# Altium schematic sheet WLAN_BLUETOOTH.SchDoc: WLAN & Bluetooth
size A4; Project: STM32MP15-DISCO PI; Date: Not used; ApprovedBy: Not used; CheckedBy: Not used; Author: Not used; CompanyName: STMicroelectronics; DrawnBy: Not used; Engineer: Not used; Organization: Not used; Address1: Not used; Address2: Not used; Address3: Not used; Address4: Not used; DocumentNumber: 9; Revision: Not used; SheetNumber: 9; SheetTotal: 17; CurrentTime: Not used; CurrentDate: Not used; Time: Not used; DocumentFullPathAndName: Not used; DocumentName: Not used; ModifiedDate: Not used; ImagePath: Not used; ProjectName: Not used; Application_BuildNumber: Not used
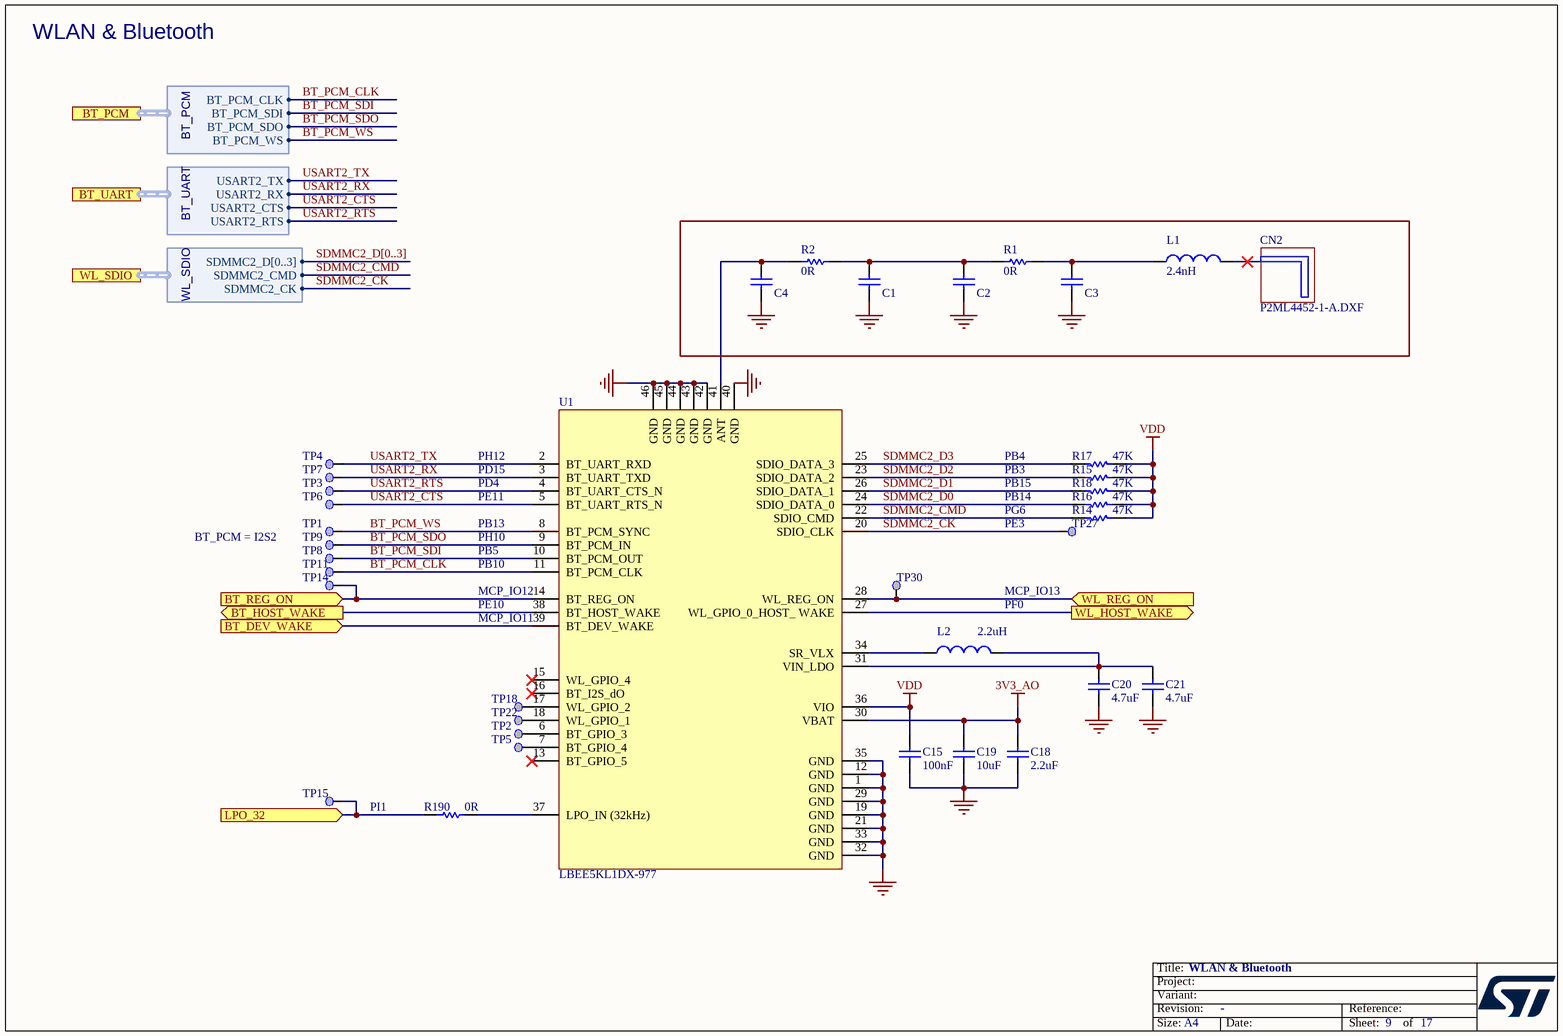
[diagram p0: WLAN_BLUETOOTH.SchDoc]

## Parts
C1  Capacitor  [C0402]  (value not drawn)
C2  Capacitor  [C0402]  (value not drawn)
C3  Capacitor  [C0402]  (value not drawn)
C4  Capacitor  [C0402]  (value not drawn)
C15  value 100nF  [C0402]  (hidden comment: Capacitor)
C18  value 2.2uF  [C0201_H0P5]  (hidden comment: Capacitor)
C19  value 10uF  [C0603]  (hidden comment: Capacitor)
C20  value 4.7uF  [C0402]  (hidden comment: Capacitor)
C21  value 4.7uF  [C0402]  (hidden comment: Capacitor)
CN2  value P2ML4452-1-A.DXF  [ANT_MURATA_TYPE-1-DX_P2ML4452-1-A_DXF]  (hidden comment: antenna_Wifi_BLE_Murata)  (no BOM)
L1  value 2.4nH  [IND_0402_MURATA_LQW15AN2N4C00X]  (hidden comment: Inductor)
L2  value 2.2uH  [L0603]  (hidden comment: Inductor)
R1  value 0R  [R0402]  (hidden comment: Resistor)
R2  value 0R  [R0402]  (hidden comment: Resistor)
R14  value 47K  [R0402]  (hidden comment: Resistor)
R15  value 47K  [R0402]  (hidden comment: Resistor)
R16  value 47K  [R0402]  (hidden comment: Resistor)
R17  value 47K  [R0402]  (hidden comment: Resistor)
R18  value 47K  [R0402]  (hidden comment: Resistor)
R190  value 0R  [R0402]  (hidden comment: Resistor)
TP1  Test Point  [TP_SMD_1MM]  (value not drawn)  (no BOM)
TP2  Test Point  [TP_SMD_1MM]  (value not drawn)  (no BOM)
TP3  Test Point  [TP_SMD_1MM]  (value not drawn)  (no BOM)
TP4  Test Point  [TP_SMD_1MM]  (value not drawn)  (no BOM)
TP5  Test Point  [TP_SMD_1MM]  (value not drawn)  (no BOM)
TP6  Test Point  [TP_SMD_1MM]  (value not drawn)  (no BOM)
TP7  Test Point  [TP_SMD_1MM]  (value not drawn)  (no BOM)
TP8  Test Point  [TP_SMD_1MM]  (value not drawn)  (no BOM)
TP9  Test Point  [TP_SMD_1MM]  (value not drawn)  (no BOM)
TP11  Test Point  [TP_SMD_1MM]  (value not drawn)  (no BOM)
TP14  Test Point  [TP_SMD_1MM]  (value not drawn)  (no BOM)
TP15  Test Point  [TP_SMD_1MM]  (value not drawn)  (no BOM)
TP18  Test Point  [TP_SMD_1MM]  (value not drawn)  (no BOM)
TP22  Test Point  [TP_SMD_1MM]  (value not drawn)  (no BOM)
TP27  Test Point  [TP_SMD_1MM]  (value not drawn)  (no BOM)
TP30  Test Point  [TP_SMD_1MM]  (value not drawn)  (no BOM)
U1  value LBEE5KL1DX-977  [MOD_WLAN-BT_MURATA_LBEE5KL1DX-883]  (hidden comment: LBEE5KL1DX-883)

## Ports
BT_DEV_WAKE (in), BT_HOST_WAKE (out), BT_PCM (harness BT_PCM), BT_REG_ON (in), BT_UART (harness BT_UART), LPO_32 (in), WL_HOST_WAKE (out), WL_REG_ON (in), WL_SDIO (harness WL_SDIO)

## Harnesses
BT_PCM: BT_PCM_CLK, BT_PCM_SDI, BT_PCM_SDO, BT_PCM_WS
BT_UART: USART2_TX, USART2_RX, USART2_CTS, USART2_RTS
WL_SDIO: SDMMC2_D[0..3], SDMMC2_CMD, SDMMC2_CK

## Nets
3V3_AO: C18.2 C19.2 U1.30(VBAT)
GND: C1.1 C2.1 C3.1 C4.1 C15.1 C18.1 C19.1 C20.1 C21.1 U1.1(GND) U1.12(GND) U1.19(GND) U1.21(GND) U1.29(GND) U1.32(GND) U1.33(GND) U1.35(GND) U1.40(GND) U1.42(GND) U1.43(GND) U1.44(GND) U1.45(GND) U1.46(GND)
VDD: C15.2 R14.1 R15.1 R16.1 R17.1 R18.1 U1.36(VIO)
BT_DEV_WAKE: U1.39(BT_DEV_WAKE) ; port BT_DEV_WAKE
BT_HOST_WAKE: U1.38(BT_HOST_WAKE) ; port BT_HOST_WAKE
BT_PCM_CLK: TP11.1 U1.11(BT_PCM_CLK) ; port BT_PCM.BT_PCM_CLK
BT_PCM_SDI: TP8.1 U1.10(BT_PCM_OUT) ; port BT_PCM.BT_PCM_SDI
BT_PCM_SDO: TP9.1 U1.9(BT_PCM_IN) ; port BT_PCM.BT_PCM_SDO
BT_PCM_WS: TP1.1 U1.8(BT_PCM_SYNC) ; port BT_PCM.BT_PCM_WS
BT_REG_ON: TP14.1 U1.14(BT_REG_ON) ; port BT_REG_ON
LPO_32: R190.1 TP15.1 ; port LPO_32
SDMMC2_CK: TP27.1 U1.20(SDIO_CLK) ; port WL_SDIO.SDMMC2_CK
SDMMC2_CMD: R14.2 U1.22(SDIO_CMD) ; port WL_SDIO.SDMMC2_CMD
SDMMC2_D0: R16.2 U1.24(SDIO_DATA_0)
SDMMC2_D1: R18.2 U1.26(SDIO_DATA_1)
SDMMC2_D2: R15.2 U1.23(SDIO_DATA_2)
SDMMC2_D3: R17.2 U1.25(SDIO_DATA_3)
USART2_CTS: TP6.1 U1.5(BT_UART_RTS_N) ; port BT_UART.USART2_CTS
USART2_RTS: TP3.1 U1.4(BT_UART_CTS_N) ; port BT_UART.USART2_RTS
USART2_RX: TP7.1 U1.3(BT_UART_TXD) ; port BT_UART.USART2_RX
USART2_TX: TP4.1 U1.2(BT_UART_RXD) ; port BT_UART.USART2_TX
WL_HOST_WAKE: U1.27(WL_GPIO_0_HOST__WAKE) ; port WL_HOST_WAKE
WL_REG_ON: TP30.1 U1.28(WL_REG_ON) ; port WL_REG_ON
NetC1_2: C1.2 C2.2 R1.2 R2.1
NetC3_2: C3.2 L1.1 R1.1
NetC4_2: C4.2 R2.2 U1.41(ANT)
NetC20_2: C20.2 C21.2 L2.2 U1.31(VIN_LDO)
NetL2_1: L2.1 U1.34(SR_VLX)
NetR190_2: R190.2 U1.37(LPO_IN_(32kHz))
NetTP2_1: TP2.1 U1.6(BT_GPIO_3)
NetTP5_1: TP5.1 U1.7(BT_GPIO_4)
NetTP18_1: TP18.1 U1.17(WL_GPIO_2)
NetTP22_1: TP22.1 U1.18(WL_GPIO_1)

Not connected (* = marked no-connect by the designer): L1 2*; U1 13(BT_GPIO_5)* 15(WL_GPIO_4)* 16(BT_I2S_dO)*

## Buses and harness runs
bus SDMMC2_D[0..3]

## Notes on the sheet
- WLAN & Bluetooth
- PD15
- PH12
- PD4
- PE11
- PG6
- PB14
- PB15
- PB3
- PB4
- BT_PCM = I2S2
- PB10
- PB5
- PH10
- PB13
- PE3
- PE10
- (near U1) MCP_IO11
- (near U1) MCP_IO12
- (near L2) PF0
- MCP_IO13
- PI1
- Title:
- Project:
- Size:
- Revision:
- Variant:
- A4
- -
- Date:
- Reference:
- Sheet:
- of

## Library data of the parts
C1-C4 = MCD-00200: Capacitor, MLCC, 12pF, 50V, NPO, +/-5%, 0402, T=0.5mm; Manufacturer_Part_Number: CC0402JRNPO9BN120; Manufacturer: YAGEO; Part_Preference: Recommended; Component_Country_Of_Origin: China; ShowFields: YES; ID: 2667; Internal_Part_Number: MCD-00200; Value: 12pF; Status: Checked; Part_Type: Capacitor; Package: 0402; ComponentLink1URL: http://tunmcdsvn.tun.st.com/Component_Documentation_Library/Trunk/Capacitor/YAGEO_NP0_Series; Order_Code_Digikey: 311-1016-1-ND; Order_Code_Farnell: 2370624; Order_Code_RS: N/A
C15 = MCD-00006: Capacitor, MLCC, 100nF, 16V, X7R, +/-10%, 0402, T=0.5mm; Manufacturer_Part_Number: CC0402KRX7R7BB104; Manufacturer: YAGEO; Part_Preference: Recommended; Order_Code_RS: 616-9701; Component_Country_Of_Origin: China; ShowFields: YES; ID: 2474; Internal_Part_Number: MCD-00006; Status: Released; Part_Type: Capacitor; Package: 0402; ComponentLink1URL: http://tunmcdsvn.tun.st.com/Component_Documentation_Library/Trunk/Capacitor/YAGEO_X7R_Series; Order_Code_Digikey: 311-1338-1-ND; Order_Code_Farnell: 9402047
C18 = MCD-02235: Capacitor, MLCC, 2.2uF, 10V, X5R,+/-10%, 0201, T=0.5mm; Manufacturer_Part_Number: GRM033R61A225KE47D; Manufacturer: MURATA; Part_Preference: Recommended; Order_Code_RS: NA; Component_Country_Of_Origin: Japan; ShowFields: YES; ID: 4335; Internal_Part_Number: MCD-02235; Status: Checked; Part_Type: Capacitor; Package: 0201; ComponentLink1URL: http://tunmcdsvn.tun.st.com/Component_Documentation_Library/Trunk/Capacitor/MURATA_GRM_Series; Order_Code_Digikey: 490-13227-1-ND; Order_Code_Farnell: NA
C19 = MCD-00099: Capacitor, MLCC, 10uF, 10V, X5R, +/-10%, 0603, T=0.8mm; Manufacturer_Part_Number: GRM188R61A106KE69D; Manufacturer: MURATA; Part_Preference: Recommended; Order_Code_RS: 170-6168; Component_Country_Of_Origin: Japan; ShowFields: YES; ID: 2770; Internal_Part_Number: MCD-00099; Status: Released; Part_Type: Capacitor; Package: 0603; ComponentLink1URL: http://tunmcdsvn.tun.st.com/Component_Documentation_Library/Trunk/Capacitor/MURATA_GRM_Series; Order_Code_Digikey: 490-10474-1-ND; Order_Code_Farnell: 2494233
C20 C21 = MCD-01356: Capacitor, MLCC, 4.7uF, 6V3, X5R, +/-20%, 0402, T=0.5mm; Manufacturer_Part_Number: GRM155R60J475ME47; Manufacturer: MURATA; Part_Preference: Recommended; Order_Code_RS: 814-5230; Component_Country_Of_Origin: Japan; ShowFields: YES; ID: 3456; Internal_Part_Number: MCD-01356; Status: Released; Part_Type: Capacitor; Package: 0402; ComponentLink1URL: http://tunmcdsvn.tun.st.com/Component_Documentation_Library/Trunk/Capacitor/MURATA_GRM_Series; Order_Code_Digikey: 490-5915-1-ND; Order_Code_Farnell: 2666407
CN2 = MCD-00656: Murata_Type1DX_AntennaDesign_P2ML4452-1-A.DXF; Part_Type: Misc; Manufacturer: MURATA; Part_Preference: Recommended; Component_Country_Of_Origin: Unknown; ShowFields: YES; ID: 3086; Internal_Part_Number: MCD-00656; Status: New; Manufacturer_Part_Number: Antenna design; ComponentLink1URL: http://tunmcdsvn.tun.st.com/Component_Datasheet_Library/Trunk/Misc/Murata_Type1DX_AntennaDesign_20160311
L1 = MCD-00657: Inductor, 2.4nH, +/-0.2nH, Itemp=850mA, 50R, 0402, T=0.6mm, Qmin=20; Manufacturer_Part_Number: LQW15AN2N4C00#; Manufacturer: MURATA; Part_Preference: Recommended; Order_Code_RS: 177-6240; Component_Country_Of_Origin: Japan; ShowFields: YES; ID: 3088; Internal_Part_Number: MCD-00657; Status: Checked; Part_Type: Inductor; Package: 0402; ComponentLink1URL: http://tunmcdsvn.tun.st.com/Component_Documentation_Library/Trunk/Inductor/MURATA_LQW15ANx_Series; Order_Code_Digikey: N/A; Order_Code_Farnell: N/A
L2 = MCD-00659: Inductor, 2.2uH, +/-20%, 1050mA, 0R2, 0603, T=1mm; Manufacturer_Part_Number: LQM18PN2R2MGH; Manufacturer: MURATA; Part_Preference: Recommended; Component_Country_Of_Origin: Japan; ShowFields: YES; ID: 3085; Internal_Part_Number: MCD-00659; Status: Checked; Part_Type: Inductor; Package: 0603; ComponentLink1URL: http://tunmcdsvn.tun.st.com/Component_Documentation_Library/Trunk/Inductor/MURATA_LQM_Series; Order_Code_Digikey: 490-14478-1-ND; Order_Code_Farnell: N/A; Order_Code_RS: N/A
R1 R2 = MCD-00052: Resistor, 0R, 0402, +/-5%, 1/16W; Manufacturer_Part_Number: RC0402JR-070RL; Manufacturer: YAGEO; Part_Preference: Recommended; Order_Code_RS: 618-5804; Component_Country_Of_Origin: China; ShowFields: YES; ID: 2540; Internal_Part_Number: MCD-00052; Status: Released; Part_Type: Resistor; Package: 0402; ComponentLink1URL: http://tunmcdsvn.tun.st.com/Component_Documentation_Library/Trunk/Resistor/YAGEO_RC_L_Series; Order_Code_Digikey: 311-0.0JRCT-ND; Order_Code_Farnell: 9232516RL
R14-R18 = MCD-00063: Resistor, 47K, 0402, +/-1%, 1/16W; Manufacturer_Part_Number: RC0402FR-0747KL; Manufacturer: YAGEO; Part_Preference: Recommended; Component_Country_Of_Origin: China; ShowFields: YES; ID: 2528; Internal_Part_Number: MCD-00063; Status: Released; Part_Type: Resistor; ComponentLink1URL: http://tunmcdsvn.tun.st.com/Component_Documentation_Library/Trunk/Resistor/YAGEO_RC_L_Series; Package: 0402; Order_Code_Digikey: 311-47.0KLRCT-ND; Order_Code_Farnell: 9239430; Order_Code_RS: N/A
R190 = MCD-00052: Resistor, 0R, 0402, +/-5%, 1/16W; Part_Preference: Recommended; Manufacturer: YAGEO; Manufacturer_Part_Number: RC0402JR-070RL; Order_Code_RS: 618-5804; Component_Country_Of_Origin: China; ShowFields: YES; ID: 2540; Internal_Part_Number: MCD-00052; Status: Released; Part_Type: Resistor; Package: 0402; ComponentLink1URL: http://tunmcdsvn.tun.st.com/Component_Documentation_Library/Trunk/Resistor/YAGEO_RC_L_Series; Order_Code_Digikey: 311-0.0JRCT-ND; Order_Code_Farnell: 9232516RL
TP1-TP9 TP11 TP14 TP15 TP18 TP22 TP27 TP30 = MCD-00074: Test Point 1mm; Part_Type: Misc; Part_Preference: Recommended; ShowFields: YES; ID: 2518; Internal_Part_Number: MCD-00074; Status: Released; Manufacturer_Part_Number: N/A; Manufacturer: N/A; ComponentLink1URL: http://na; Order_Code_Digikey: N/A; Order_Code_Farnell: N/A; Order_Code_RS: N/A
U1 = MCD-00268: IEEE802.11b/g/n W-LAN + Bluetooth 4.1+EDR module; Manufacturer: MURATA; Part_Type: IC; Part_Preference: Recommended; Component_Country_Of_Origin: Japan; ShowFields: YES; ID: 2603; Internal_Part_Number: MCD-00268; Manufacturer_Part_Number: LBEE5KL1DX-977; ComponentLink1URL: http://tunmcdsvn.tun.st.com/Component_Datasheet_Library/Trunk/IC/MURATA_LBEE5KL1DX_wifi_BLE; Status: Released